# Altium project SVPXGR740_3U.PrjPcb (part 6 of 8)

## Sheet PWR_3V3.SchDoc
size A3
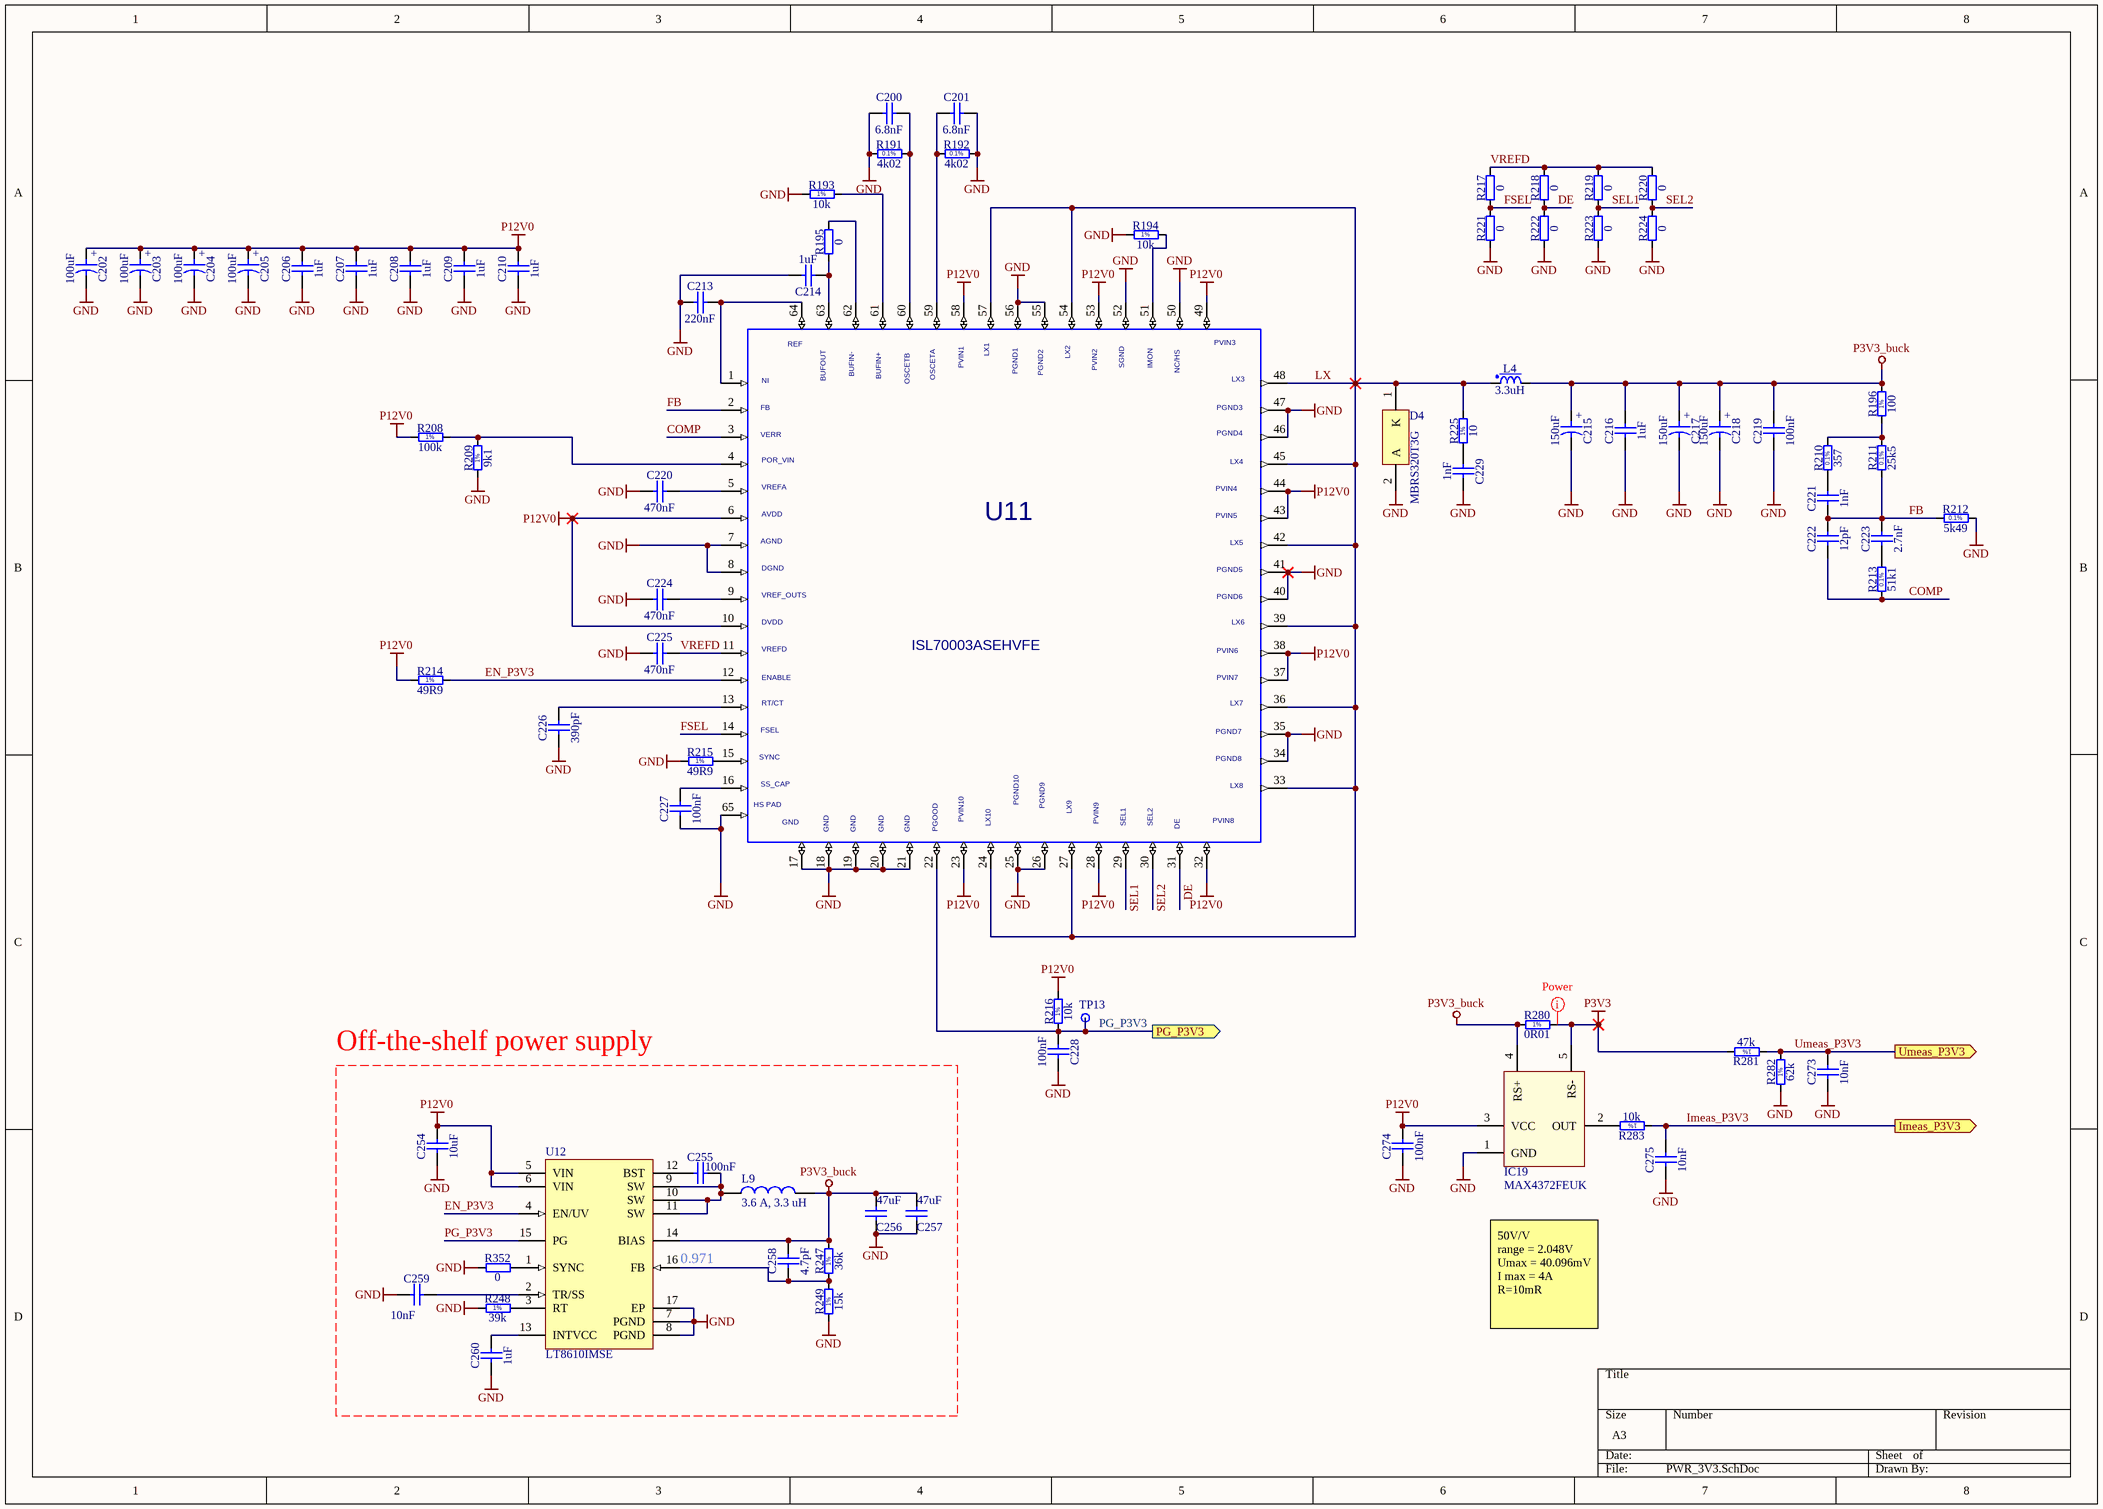
[diagram p20: PWR_3V3.SchDoc]

### Parts
C200  6.8nF  [CAPC1005X55N]
C201  6.8nF  [CAPC1005X55N]
C202  100uF  [CAPMP7343X430N]
C203  100uF  [CAPMP7343X430N]
C204  100uF  [CAPMP7343X430N]
C205  100uF  [CAPMP7343X430N]
C206  1uF  [CAPC5650X165N]
C207  1uF  [CAPC5650X165N]
C208  1uF  [CAPC5650X165N]
C209  1uF  [CAPC5650X165N]
C210  1uF  [CAPC5650X165N]
C213  220nF  [CAPC1005X55N]
C214  1uF  [CAPC1005X55N]
C215  150uF  [CAPMP6032X280N]
C216  1uF  [CAPC5650X165N]
C217  150uF  [CAPMP6032X280N]
C218  150uF  [CAPMP6032X280N]
C219  100nF  [CAPC1608X87N]
C220  470nF  [CAPC1005X55N]
C221  1nF  [CAPC1005X55N]
C222  12pF  [CAPC1005X55N]
C223  2.7nF  [CAPC1005X55N]
C224  470nF  [CAPC1005X55N]
C225  470nF  [CAPC1005X55N]
C226  390pF  [CAPC1608X87N]
C227  100nF  [CAPC1005X55N]
C228  100nF  [CAPC1005X55N]
C229  1nF  [CAPC1608X90N]
C254  10uF  [CAPC2012X95N]
C255  100nF  [CAPC1005X55N]
C256  47uF  [CAPC2012X140N]
C257  47uF  [CAPC2012X140N]
C258  4.7pF  [CAPC1005X55N]
C259  10nF  [CAPC1005X55N]
C260  1uF  [CAPC1608X87N]
C273  10nF  [CAPC1005X55N]
C274  100nF  [CAPC1005X55N]
C275  10nF  [CAPC1005X55N]
D4  MBRS320T3G  [ONSC-SMC-2-403-03_V]
IC19  MAX4372FEUK  [SOT95P270X145-5N]
L4  3.3uH  [IND_LAIRD_MGV10043R3M-10]
L9  3.6 A, 3.3 uH  [WE-MAIA_4020]
R191  4k02  [RESC1608X55N]
R192  4k02  [RESC1608X55N]
R193  10k  [RESC1005X40N]
R194  10k  [RESC1005X40N]
R195  0  [RESC1005X40N]
R196  100  [RESC1005X40N]
R208  100k  [RESC1005X40N]
R209  9k1  [RESC1005X40N]
R210  357  [RESC1608X55N]
R211  25k5  [RESC1608X55N]
R212  5k49  [RESC1608X55N]
R213  51k1  [RESC1608X55N]
R214  49R9  [RESC1608X55N]
R215  49R9  [RESC1005X40N]
R216  10k  [RESC1005X40N]
R217  0  [RESC1005X40N]
R218  0  [RESC1005X40N]
R219  0  [RESC1005X40N]
R220  0  [RESC1005X40N]
R221  0  [RESC1005X40N]
R222  0  [RESC1005X40N]
R223  0  [RESC1005X40N]
R224  0  [RESC1005X40N]
R225  10  [RESC2012X60N]
R247  36k  [RESC1005X40N]
R248  39k  [RESC1005X40N]
R249  15k  [RESC1005X40N]
R280  0R01  [RESC3216X80N]
R281  47k  [RESC1005X40N]
R282  62k  [RESC1005X40N]
R283  10k  [RESC1005X40N]
R352  0  [RESC1005X40N]
TP13  Test Point  [TPS127]  (value not drawn)
U11  PART_NUMBER: ISL70003ASEHVFE  [CQFP64_555X555_635_EP]  (hidden comment: ISL70003ASEH)
U12  LT8610IMSE  [LT-MSE-16-EDP_L]

### Ports
Imeas_P3V3 (out), PG_P3V3 (out), Umeas_P3V3 (out)

### Nets
GND: C200.1 C201.2 C202.2 C203.2 C204.2 C205.2 C206.1 C207.1 C208.1 C209.1 C210.1 C213.1 C214.2 C215.2 C216.1 C217.2 C218.2 C219.1 C220.1 C224.1 C225.1 C226.1 C227.1 C228.2 C229.2 C254.1 C256.1 C257.1 C259.1 C260.1 C273.1 C274.1 C275.1 D4.2(A) IC19.1(GND) R191.1 R192.2 R193.1 R194.1 R209.1 R212.2 R215.1 R221.1 R222.1 R223.1 R224.1 R248.1 R249.1 R282.1 R352.1 U11.7 U11.8 U11.17 U11.18 U11.19 U11.20 U11.21 U11.25 U11.26 U11.34 U11.35 U11.40 U11.41 U11.46 U11.47 U11.50 U11.52 U11.55 U11.56 U11.65(EP) U12.7(PGND) U12.8(PGND) U12.17(EP)
P3V3: IC19.5(RS-) R280.2 R281.2  [project net 3.3V]
P3V3_buck: C215.1 C216.2 C217.1 C218.1 C219.2 C256.2 C257.2 C258.2 IC19.4(RS+) L4.2 L9.2 R196.2 R247.2 R280.1 U12.14(BIAS)
P12V0: C202.1 C203.1 C204.1 C205.1 C206.2 C207.2 C208.2 C209.2 C210.2 C254.2 C274.2 IC19.3(VCC) R208.1 R214.1 R216.2 U11.6 U11.10 U11.23 U11.28 U11.32 U11.37 U11.38 U11.43 U11.44 U11.49 U11.53 U11.58 U12.5(VIN) U12.6(VIN)  [project net VS1]
COMP: C222.1 R213.1 U11.3
DE: R218.1 R222.2 U11.31
EN_P3V3: R214.2 U11.12 U12.4(EN/UV)
FB: C221.1 C222.2 C223.2 R211.1 R212.1 U11.2
FSEL: R217.1 R221.2 U11.14
Imeas_P3V3: C275.2 R283.1 ; port Imeas_P3V3
LX: D4.1(K) L4.1 R225.2 U11.24 U11.27 U11.33 U11.36 U11.39 U11.42 U11.45 U11.48 U11.54 U11.57
PG_P3V3: C228.1 R216.1 TP13.1 U11.22 U12.15(PG) ; port PG_P3V3  [project net PGP3V3]
SEL1: R219.1 R223.2 U11.29
SEL2: R220.1 R224.2 U11.30
Umeas_P3V3: C273.2 R281.1 R282.2 ; port Umeas_P3V3
VREFD: C225.2 R217.2 R218.2 R219.2 R220.2 U11.11
NetC200_2: C200.2 R191.2 U11.60
NetC201_1: C201.1 R192.1 U11.59
NetC213_2: C213.2 U11.1 U11.64
NetC214_1: C214.1 R195.1 U11.63
NetC220_2: C220.2 U11.5
NetC221_2: C221.2 R210.1
NetC223_1: C223.1 R213.2
NetC224_2: C224.2 U11.9
NetC226_2: C226.2 U11.13
NetC227_2: C227.2 U11.16
NetC229_1: C229.1 R225.1
NetC255_1: C255.1 U12.12(BST)
NetC255_2: C255.2 L9.1 U12.9(SW) U12.10(SW) U12.11(SW)
NetC258_1: C258.1 R247.1 R249.2 U12.16(FB)
NetC259_2: C259.2 U12.2(TR/SS)
NetC260_2: C260.2 U12.13(INTVCC)
NetIC19_2: IC19.2(OUT) R283.2
NetR193_2: R193.2 U11.61
NetR194_2: R194.2 U11.51
NetR195_2: R195.2 U11.62
NetR196_1: R196.1 R210.2 R211.2
NetR208_2: R208.2 R209.2 U11.4
NetR215_2: R215.2 U11.15
NetR248_2: R248.2 U12.3(RT)
NetR352_2: R352.2 U12.1(SYNC)

### Layout directives
net class Power: 3.3V

### Notes on the sheet
- Off-the-shelf power supply
- (near U12) 0.971
- 50V/V
  range = 2.048V
  Umax = 40.096mV
  I max = 4A
  R=10mR
- (in symbol CTE6032-28_150UF_10V_10%) +
- (in symbol CTE7343-43_100UF_25V_10%_LESR0150) +
- (in symbol ISL70003ASEH) REF; PVIN3; LX1; LX2; PVIN1; PVIN2; SGND; IMON; BUFIN-; BUFIN+; PGND1; PGND2; NC/HS; NI; BUFOUT; OSCETB; OSCETA; LX3; FB; PGND3; VERR; PGND4; POR_VIN; LX4; VREFA; PVIN4; AVDD; PVIN5; AGND; LX5; DGND; PGND5; VREF_OUTS; PGND6; DVDD; LX6; VREFD; PVIN6; ENABLE; PVIN7; RT/CT; LX7; FSEL; PGND7; SYNC; PGND8; SS_CAP; LX8; HS PAD; PGND10; PGND9; LX9; PVIN10; PVIN9; GND; PGOOD; LX10; SEL1; SEL2; DE; PVIN8
- (in symbol R0402_9K1_1%_0.0625W_100PPM) 1%
- (in symbol R0402_10K_1%_0.0625W_100PPM) 1%
- (in symbol R0402_15K_1%_0.0625W_100PPM) 1%
- (in symbol R0402_36K_1%_0.0625W_100PPM) 1%
- (in symbol R0402_39K_1%_0.0625W_100PPM) 1%
- (in symbol R0402_47K_1%_0.0625W_100PPM) 1%
- (in symbol R0402_49R9_1%_0.0625W_100PPM) 1%
- (in symbol R0402_62K_1%_0.0625W_100PPM) 1%
- (in symbol R0402_100K_1%_0.0625W_100PPM) 1%
- (in symbol R0402_100R_1%_0.0625W_100PPM) 1%
- (in symbol R0603_4K02_0.1%_0.063W_10PPM) 0.1%
- (in symbol R0603_5K49_0.1%_0.063W_10PPM) 0.1%
- (in symbol R0603_25K5_0.1%_0.063W_10PPM) 0.1%
- (in symbol R0603_49K9_1%_0.1W_100PPM) 1%
- (in symbol R0603_51K1_0.1%_0.063W_10PPM) 0.1%
- (in symbol R0603_357R_0.1%_0.063W_10PPM) 0.1%
- (in symbol R0805_10R_1%_0.125W_200PPM) 1%
- (in symbol R1206_0R01_1%_1W_100PPM_TT_LRMAM1206) 1%

### Library data of the parts
C200 C201 = CC0402_6.8NF_16V_10%_X7R: Non-polarised capacitor; Part Description: SMD Multilayer Chip Ceramic Capacitor; Manufacturer: GENERIC; Manufacturer1 Part Number: 223878715634; Voltage: 16V; TC: X7R; Tolerance: ±10%; Part Number: CC0402_6.8NF_16V_10%_X7R; Component Kind: Standard; Component Type: Standard; Pin Count: 2; Value: 6.8nF; Status: Not Recommended; Manufacturer Part Number: CC0402_6.8NF_16V_10%_X7R; Case: 0402; Mounted: Yes; Socket: No; SMD: Yes; Sense: No; Manufacturer1 Example: PHYCOMP; Manufacturer1 ComponentHeight: 0.55mm; HelpURL: \\cern.ch\dfs\Applications\Altium\Datasheets\CC0402_X7R_PHYCOMP.pdf; Author: CERN DEM JLC; CreateDate: 03.12.2007; LatestRevisionDate: 03.12.2007
C202-C205 = CTE7343-43_100UF_25V_10%_LESR0150: Polarised capacitor; Part Description: Low ESR 0R15 Solid Tantalum Chip Capacitor; Manufacturer: GENERIC; Manufacturer1 Part Number: TPSE107K025R0150; Voltage: 25V; Tolerance: ±10%; Part Number: CTE7343-43_100UF_25V_10%_LESR0150; Component Kind: Standard; Component Type: Standard; Pin Count: 2; Value: 100uF; Status: Preferred; Manufacturer Part Number: CTE7343-43_100UF_25V_10%_LESR0150; Case: E; Mounted: Yes; Socket: No; SMD: Yes; Sense: No; Manufacturer1 Example: AVX; Manufacturer1 ComponentHeight: 4.3mm; HelpURL: \\cern.ch\dfs\Applications\Altium\Datasheets\CTE-LESR_AVX_TPS.pdf; Author: CERN DEM JLC; CreateDate: 13.12.2018; LatestRevisionDate: 13.12.2018
C206-C210 C216 = CC2220_1UF_200V_10%_X7R: Non-polarised capacitor; Part Description: SMD Ceramic Chip Capacitor; Manufacturer: GENERIC; Manufacturer1 Part Number: C2220X105K2RAC; Voltage: 200V; TC: X7R; Tolerance: ±10%; Part Number: CC2220_1UF_200V_10%_X7R; Component Kind: Standard; Component Type: Standard; Pin Count: 2; Value: 1uF; Status: None; Manufacturer Part Number: CC2220_1UF_200V_10%_X7R; Case: 2220; Mounted: Yes; Socket: No; SMD: Yes; Sense: No; Manufacturer1 Example: KEMET; Manufacturer1 ComponentHeight: 1.65mm; HelpURL: \\cern.ch\dfs\Applications\Altium\Datasheets\CC2220_X7R_KEMET.pdf; Author: CERN DEM JLC; CreateDate: 16.09.2009; LatestRevisionDate: 16.09.2009
C213 = CC0402_220NF_16V_10%_X7R: as C181 on sheet Power; Part Number: CC0402_220NF_16V_10%_X7R; Component Kind: Standard; Component Type: Standard; Pin Count: 2; Value: 220nF; Status: Preferred; Manufacturer Part Number: CC0402_220NF_16V_10%_X7R; Case: 0402; Mounted: Yes; Socket: No; SMD: Yes; Sense: No; Manufacturer1 Example: TDK; Manufacturer1 ComponentHeight: 0.55mm; HelpURL: \\cern.ch\dfs\Applications\Altium\Datasheets\CC0402_X7R_TDK_C.pdf; Author: CERN DEM JLC; CreateDate: 25.10.2012; LatestRevisionDate: 25.10.2012
C214 = CC0402_1UF_16V_10%_X5R: as C170 on sheet Power; Part Number: CC0402_1UF_16V_10%_X5R; Component Kind: Standard; Component Type: Standard; Pin Count: 2; Value: 1uF; Status: Preferred; Manufacturer Part Number: CC0402_1UF_16V_10%_X5R; Case: 0402; Mounted: Yes; Socket: No; SMD: Yes; Sense: No; Manufacturer1 Example: TDK; Manufacturer1 ComponentHeight: 0.55mm; HelpURL: \\cern.ch\dfs\Applications\Altium\Datasheets\CC0402_X5R_TDK_C.pdf; Author: CERN DEM JLC; CreateDate: 25.10.2012; LatestRevisionDate: 25.10.2012
C215 C217 C218 = CTE6032-28_150UF_10V_10%: as C175 on sheet Power; Part Number: CTE6032-28_150UF_10V_10%; Component Kind: Standard; Component Type: Standard; Pin Count: 2; Value: 150uF; Status: Preferred; Manufacturer Part Number: CTE6032-28_150UF_10V_10%; Case: C; Mounted: Yes; Socket: No; SMD: Yes; Sense: No; Manufacturer1 Example: AVX; Manufacturer1 ComponentHeight: 2.8mm; HelpURL: \\cern.ch\dfs\Applications\Altium\Datasheets\CTE_AVX_TAJ.pdf; Author: CERN DEM JLC; CreateDate: 03.12.2007; LatestRevisionDate: 03.12.2007
C219 = CC0603_100NF_50V_10%_X5R: Non-polarised capacitor; Part Description: SMD Multilayer Chip Ceramic Capacitor; Manufacturer: GENERIC; Manufacturer1 Part Number: C1608X5R1H104K080AA; Voltage: 50V; TC: X5R; Tolerance: ±10%; Part Number: CC0603_100NF_50V_10%_X5R; Component Kind: Standard; Component Type: Standard; Pin Count: 2; Value: 100nF; Status: None; Manufacturer Part Number: CC0603_100NF_50V_10%_X5R; Case: 0603; Mounted: Yes; Socket: No; SMD: Yes; Sense: No; Manufacturer1 Example: TDK; Manufacturer1 ComponentHeight: 0.9mm; HelpURL: \\cern.ch\dfs\Applications\Altium\Datasheets\CC0603_X5R_TDK_C.pdf; Author: CERN DEM MR; CreateDate: 08.01.2016; LatestRevisionDate: 08.01.2016
C220 C224 C225 = CC0402_470NF_16V_10%_X5R: Non-polarised capacitor; Part Description: SMD Multilayer Chip Ceramic Capacitor; Manufacturer: GENERIC; Manufacturer1 Part Number: C1005X5R1C105KT; Voltage: 16V; TC: X5R; Tolerance: ±10%; Part Number: CC0402_470NF_16V_10%_X5R; Component Kind: Standard; Component Type: Standard; Pin Count: 2; Value: 470nF; Status: Preferred; Manufacturer Part Number: CC0402_470NF_16V_10%_X5R; Case: 0402; Mounted: Yes; Socket: No; SMD: Yes; Sense: No; Manufacturer1 Example: TDK; Manufacturer1 ComponentHeight: 0.55mm; HelpURL: \\cern.ch\dfs\Applications\Altium\Datasheets\CC0402_X5R_TDK_C.pdf; Author: CERN DEM JLC; CreateDate: 25.10.2012; LatestRevisionDate: 25.10.2012
C221 = CC0402_1NF_50V_10%_X7R: Non-polarised capacitor; Part Description: SMD Multilayer Chip Ceramic Capacitor; Manufacturer: GENERIC; Manufacturer1 Part Number: 223858715623; Voltage: 50V; TC: X7R; Tolerance: ±10%; Part Number: CC0402_1NF_50V_10%_X7R; Component Kind: Standard; Component Type: Standard; Pin Count: 2; Value: 1nF; Status: Not Recommended; Manufacturer Part Number: CC0402_1NF_50V_10%_X7R; Case: 0402; Mounted: Yes; Socket: No; SMD: Yes; Sense: No; Manufacturer1 Example: PHYCOMP; Manufacturer1 ComponentHeight: 0.55mm; HelpURL: \\cern.ch\dfs\Applications\Altium\Datasheets\CC0402_X7R_PHYCOMP.pdf; Author: CERN DEM JLC; CreateDate: 03.12.2007; LatestRevisionDate: 03.12.2007
C222 = CC0402_12PF_50V_5%_C0G: Non-polarised capacitor; Part Description: SMD Multilayer Chip Ceramic Capacitor; Manufacturer: GENERIC; Manufacturer1 Part Number: C0402C120J5GACTU; Voltage: 50V; TC: C0G/NP0; Tolerance: ±5%; Part Number: CC0402_12PF_50V_5%_C0G; Component Kind: Standard; Component Type: Standard; Pin Count: 2; Value: 12pF; Status: Preferred; Manufacturer Part Number: CC0402_12PF_50V_5%_C0G; Case: 0402; Mounted: Yes; Socket: No; SMD: Yes; Sense: No; Manufacturer1 Example: KEMET; Manufacturer1 ComponentHeight: 0.55mm; HelpURL: \\cern.ch\dfs\Applications\Altium\Datasheets\CC0805_C0G_KEMET_(Commercial Grade).pdf; Author: CERN DEM JLC; CreateDate: 04.10.2016; LatestRevisionDate: 04.10.2016
C223 = CC0402_2.7NF_50V_10%_X7R: Non-polarised capacitor; Part Description: SMD Multilayer Chip Ceramic Capacitor; Manufacturer: GENERIC; Manufacturer1 Part Number: 223858715628 or CC0402KRX7R9BB272; Voltage: 50V; TC: X7R; Tolerance: ±10%; Part Number: CC0402_2.7NF_50V_10%_X7R; Component Kind: Standard; Component Type: Standard; Pin Count: 2; Value: 2.7nF; Status: Preferred; Manufacturer Part Number: CC0402_2.7NF_50V_10%_X7R; Case: 0402; Mounted: Yes; Socket: No; SMD: Yes; Sense: No; Manufacturer1 Example: YAGEO PHYCOMP; Manufacturer1 ComponentHeight: 0.55mm; HelpURL: \\cern.ch\dfs\Applications\Altium\Datasheets\CC0402_X7R_PHYCOMP_6.3VTO50V.pdf; Author: CERN DEM JLC; CreateDate: 25.10.2012; LatestRevisionDate: 25.10.2012
C226 = CC0603_390PF_50V_5%_NP0: Non-polarised capacitor; Part Description: SMD Multilayer Chip Ceramic Capacitor; Manufacturer: GENERIC; Manufacturer1 Part Number: 223886715391; Voltage: 50V; TC: NP0; Tolerance: ±5%; Part Number: CC0603_390PF_50V_5%_NP0; Component Kind: Standard; Component Type: Standard; Pin Count: 2; Value: 390pF; Status: Preferred; Manufacturer Part Number: CC0603_390PF_50V_5%_NP0; Case: 0603; Mounted: Yes; Socket: No; SMD: Yes; Sense: No; Manufacturer1 Example: PHYCOMP; Manufacturer1 ComponentHeight: 0.87mm; HelpURL: \\cern.ch\dfs\Applications\Altium\Datasheets\CC0603_NP0_PHYCOMP.pdf; Author: CERN DEM JLC; CreateDate: 03.12.2007; LatestRevisionDate: 03.12.2007
C227 C228 = CC0402_100NF_16V_10%_X5R: as C177 on sheet Power; Part Number: CC0402_100NF_16V_10%_X5R; Component Kind: Standard; Component Type: Standard; Pin Count: 2; Value: 100nF; Status: None; Manufacturer Part Number: CC0402_100NF_16V_10%_X5R; Case: 0402; Mounted: Yes; Socket: No; SMD: Yes; Sense: No; Manufacturer1 Example: MURATA; Manufacturer1 ComponentHeight: 0.55mm; HelpURL: \\cern.ch\dfs\Applications\Altium\Datasheets\CC0402_X5R_MURATA_GRM.pdf; Author: CERN DEM JLC; CreateDate: 10.12.2013; LatestRevisionDate: 10.12.2013
C229 = CC0603_1NF_50V_1%_NP0: as C176 on sheet Power; Part Number: CC0603_1NF_50V_1%_NP0; Component Kind: Standard; Component Type: Standard; Pin Count: 2; Value: 1nF; Status: None; Manufacturer Part Number: CC0603_1NF_50V_1%_NP0; Case: 0603; Mounted: Yes; Socket: No; SMD: Yes; Sense: No; Manufacturer1 Example: AVX; Manufacturer1 ComponentHeight: 0.9mm; HelpURL: \\cern.ch\dfs\Applications\Altium\Datasheets\CC0603_C0G_AVX.pdf; Author: CERN DEM JLC; CreateDate: 15.06.2017; LatestRevisionDate: 15.06.2017
C254 = CC0805_10UF_25V_10%_X5R: Non-polarised capacitor; Part Description: SMD Multilayer Chip Ceramic Capacitor; Manufacturer: GENERIC; Manufacturer1 Part Number: GRM219R61E106KA12D; Voltage: 25V; TC: X5R; Tolerance: ±10%; Part Number: CC0805_10UF_25V_10%_X5R; Component Kind: Standard; Component Type: Standard; Pin Count: 2; Value: 10uF; Status: Preferred; Manufacturer Part Number: CC0805_10UF_25V_10%_X5R; Case: 0805; Mounted: Yes; Socket: No; SMD: Yes; Sense: No; Manufacturer1 Example: MURATA; Manufacturer1 ComponentHeight: 0.95mm; HelpURL: \\cern.ch\dfs\Applications\Altium\Datasheets\CC0805_X5R_MURATA_GRM.pdf; Author: CERN DEM JLC; CreateDate: 25/10/2012; LatestRevisionDate: 06/09/2016
C255 C274 = CC0402_100NF_25V_10%_X7R_YUDEN_TMK105B7104KVHF: as C270 on sheet Power; Part Number: CC0402_100NF_25V_10%_X7R_YUDEN_TMK105B7104KVHF; Component Kind: Standard; Component Type: Standard; Pin Count: 2; Value: 100nF; Status: Not Recommended; Manufacturer Part Number: TMK105B7104KVHF; Case: 0402; Mounted: Yes; Socket: No; SMD: Yes; Sense: No; ComponentHeight: 0.55mm; HelpURL: \\cern.ch\dfs\Applications\Altium\Datasheets\CC0402_TAIYO-YUDEN_TMK105B7104KVHF.pdf; Author: CERN DEM JLC; CreateDate: 10/05/2017; LatestRevisionDate: 10/05/2017
C256 C257 = CC0805_47UF_6.3V_20%_X5R: Non-polarised capacitor; Manufacturer: GENERIC; Part Description: SMD Multilayer Chip Ceramic Capacitor; Manufacturer1 Part Number: C0805C476M9PACTU; Voltage: 6.3V; TC: X5R; Tolerance: ±20%; Part Number: CC0805_47UF_6.3V_20%_X5R; Component Kind: Standard; Component Type: Standard; Pin Count: 2; Value: 47uF; Status: Preferred; Manufacturer Part Number: CC0805_47UF_6.3V_20%_X5R; Case: 0805; Mounted: Yes; Socket: No; SMD: Yes; Sense: No; Manufacturer1 Example: KEMET; Manufacturer1 ComponentHeight: 1.4mm; HelpURL: \\cern.ch\dfs\Applications\Altium\Datasheets\CC0805_X5R_KEMET.pdf; Author: CERN DEM JLC; CreateDate: 16/10/2012; LatestRevisionDate: 16/10/2012
C258 = CC0402_4.7PF_50V_0.25PF_C0G: Non-polarised capacitor; Part Description: SMD Multilayer Chip Ceramic Capacitor; Manufacturer: GENERIC; Manufacturer1 Part Number: C0402C479C5GACTU; Voltage: 50V; TC: C0G/NP0; Tolerance: ±0.25pF; Part Number: CC0402_4.7PF_50V_0.25PF_C0G; Component Kind: Standard; Component Type: Standard; Pin Count: 2; Value: 4.7pF; Status: Preferred; Manufacturer Part Number: CC0402_4.7PF_50V_0.25PF_C0G; Case: 0402; Mounted: Yes; Socket: No; SMD: Yes; Sense: No; Manufacturer1 Example: KEMET; Manufacturer1 ComponentHeight: 0.55mm; HelpURL: \\cern.ch\dfs\Applications\Altium\Datasheets\CC0805_C0G_KEMET_(Commercial Grade).pdf; Author: CERN DEM JLC; CreateDate: 03/12/2007; LatestRevisionDate: 22/04/2015
C259 = CC0402_10NF_25V_10%_X7R: Non-polarised capacitor; Part Description: SMD Multilayer Chip Ceramic Capacitor; Manufacturer: GENERIC; Manufacturer1 Part Number: C1005X7R1E103KT; Voltage: 25V; TC: X7R; Tolerance: ±10%; Part Number: CC0402_10NF_25V_10%_X7R; Component Kind: Standard; Component Type: Standard; Pin Count: 2; Value: 10nF; Status: Preferred; Manufacturer Part Number: CC0402_10NF_25V_10%_X7R; Case: 0402; Mounted: Yes; Socket: No; SMD: Yes; Sense: No; Manufacturer1 Example: TDK; Manufacturer1 ComponentHeight: 0.55mm; HelpURL: \\cern.ch\dfs\Applications\Altium\Datasheets\CC0402_X7R_TDK_C.pdf; Author: CERN DEM JLC; CreateDate: 25/10/2012; LatestRevisionDate: 25/10/2012
C260 = CC0603_1UF_25V_10%_X7R: Non-polarised capacitor; Part Description: SMD Multilayer Chip Ceramic Capacitor; Manufacturer: GENERIC; Manufacturer1 Part Number: GRM188R71E105KA12D; Voltage: 25V; TC: X7R; Tolerance: ±10%; Part Number: CC0603_1UF_25V_10%_X7R; Component Kind: Standard; Component Type: Standard; Pin Count: 2; Value: 1uF; Status: None; Manufacturer Part Number: CC0603_1UF_25V_10%_X7R; Case: 0603; Mounted: Yes; Socket: No; SMD: Yes; Sense: No; Manufacturer1 Example: MURATA; Manufacturer1 ComponentHeight: 0.9mm; HelpURL: \\cern.ch\dfs\Applications\Altium\Datasheets\CC0603_X7R_MURATA.pdf; Author: CERN DEM JLC; CreateDate: 18/01/2011; LatestRevisionDate: 18/01/2011
C273 C275 = CC0402_10NF_50V_10%_X7R: as C267-C269 on sheet Power; Part Number: CC0402_10NF_50V_10%_X7R; Component Kind: Standard; Component Type: Standard; Pin Count: 2; Value: 10nF; Status: None; Manufacturer Part Number: CC0402_10NF_50V_10%_X7R; Case: 0402; Mounted: Yes; Socket: No; SMD: Yes; Sense: No; Manufacturer1 Example: MURATA; Manufacturer1 ComponentHeight: 0.55mm; HelpURL: \\cern.ch\dfs\Applications\Altium\Datasheets\CC0402_X7R_MURATA_GRM.pdf; Author: CERN DEM MR; CreateDate: 08/01/2016; LatestRevisionDate: 08/01/2016
D4 = CMP-1055-00376-1: Schottky Power Rectifier, 2-Pin SMC, Pb-Free, Tape and Reel; Manufacturer: On Semiconductor; Configuration: Single; IFSM Max (A): 80; PackageVersion: Rev. E, 08/2005; DatasheetVersion: Rev. 11; PackageReference: SMC-2-403-03; ComponentLink3URL: http://www.onsemi.com/pub_link/Collateral/403-03.PDF; ComponentLink2Description: Datasheet; ComponentLink3Description: Package Specification; PackageDescription: 2-Pin Small Molded Package, J-Bend Lead, Body 5.845 x 6.855 mm; ComponentLink1URL: http://www.onsemi.com/; PartNumber: MBRS320T3G; ComponentLink1Description: Manufacturer URL; Packing: Tape and Reel; RoHS: TRUE; ComponentLink2URL: http://www.onsemi.cn/pub_link/Collateral/MBRS340T3-D.PDF; Mounting Technology: Surface Mount
IC19 = PM_MAX4372FEUK: Manufacturer: Maxim; Part Description: High side current sense amplifier (x50); Bonding: No; PressFit: No; Case: SOT23-5; Component Kind: Standard; Component Type: Standard; ComponentHeigth: *; CreateDate: 2018-01-01; Device: MAX4372FEUK; Footprint: SOT23-5; HelpURL: *; LatestRevisionDate: 2018-01-01; Manufacturer Part Number: MAX4372FEUK; Mounted: Yes; PackageDescription: SOT23-5; Part Number: MAX4372FEUK; Pin Count: 5; Sense: No; SMD: Yes; Socket: No; Value: MAX4372FEUK
L4 = IND_3.3UH_20%_LAIRD_MGV10043R3M-10: Inductor With Magnetic core 1Dot; Part Description: High Current & Low Profile SMD Power Inductor; Manufacturer: LAIRD TECHNOLOGIES; Power: 10A; Resistance: 0.0118R; Tolerance: ±20%; Part Number: IND_3.3UH_20%_LAIRD_MGV10043R3M-10; Component Kind: Standard; Component Type: Standard; Pin Count: 2; Value: 3.3uH; Status: None; Manufacturer Part Number: MGV10043R3M-10; Mounted: Yes; Socket: No; SMD: Yes; Sense: No; ComponentHeight: 4.3mm; HelpURL: \\cern.ch\dfs\Applications\Altium\Datasheets\IND_LAIRD_MGV10043R3M-10.pdf; Author: CERN DEM BC; CreateDate: 07.09.2015; LatestRevisionDate: 07.09.2015
L9 = 78438356033: WE-MAIA SMD Power Inductor, size 4020, 3.6 A, 3.3 uH; Rated Current: 3.6 A; Inductance: 3.3 uH; DC Resistance max.: 48 mOhm; ComponentLink1Description: Manufacturer; ComponentLink1URL: http://www.we-online.de; ComponentLink2Description: Datasheet; ComponentLink2URL: http://katalog.we-online.de/pbs/datasheet/78438356033.pdf; Part Number: 78438356033; Published Date: Nov. 2017; Publisher: Wurth Elektronik; Size: 4020; Operating Temperature: -40 to 125 degC
R191 R192 = R0603_4K02_0.1%_0.063W_10PPM: Resistor - 0.1%; Part Description: Thin Film Chip Resistor; Manufacturer: GENERIC; Manufacturer1 Part Number: RN73C1J4K02BTDF; Power: 0.063W; TC: ±10ppm; PressFit: No; Part Number: R0603_4K02_0.1%_0.063W_10PPM; Component Kind: Standard; Component Type: Standard; Pin Count: 2; Value: 4k02; Status: Not Recommended; Tolerance: ±0.1%; Manufacturer Part Number: R0603_4K02_0.1%_0.063W_10PPM; Case: 0603; Mounted: Yes; Sense: No; Socket: No; SMD: Yes; Manufacturer1 Example: TYCO HOLSWORTHY; Manufacturer1 ComponentHeight: 0.5mm; HelpURL: \\cern.ch\dfs\Applications\Altium\Datasheets\R0603_Tyco_RN73.pdf; Author: CERN DEM JLC; CreateDate: 03.12.2007; LatestRevisionDate: 13.03.2008
R193 R194 R216 R283 = R0402_10K_1%_0.0625W_100PPM: as R177 on sheet Power; Part Number: R0402_10K_1%_0.0625W_100PPM; Component Kind: Standard; Component Type: Standard; Pin Count: 2; Value: 10k; Status: Not Recommended; Power: 0.0625W; Tolerance: ±1%; Manufacturer Part Number: R0402_10K_1%_0.0625W_100PPM; Case: 0402; Mounted: Yes; Sense: No; Socket: No; SMD: Yes; Manufacturer1 Example: YAGEO PHYCOMP; Manufacturer1 ComponentHeight: 0.4mm; HelpURL: \\cern.ch\dfs\Applications\Altium\Datasheets\R0402_Phycomp_RC0402.pdf; Author: CERN DEM JLC
  R193 R194 R216: CreateDate: 03.12.2007; LatestRevisionDate: 17.10.2012
  R283: CreateDate: 03/12/2007; LatestRevisionDate: 17/10/2012
R195 R217-R224 R352 = R0402_0R_JUMPER: as R175 on sheet Power; Part Number: R0402_0R_JUMPER; Component Kind: Standard; Component Type: Standard; Pin Count: 2; Value: 0; Status: Not Recommended; Manufacturer Part Number: R0402_0R_JUMPER; Case: 0402; Mounted: Yes; Sense: No; Socket: No; SMD: Yes; Manufacturer1 Example: YAGEO PHYCOMP; Manufacturer1 ComponentHeight: 0.4mm; HelpURL: \\cern.ch\dfs\Applications\Altium\Datasheets\R0402_Phycomp_RC0402.pdf; Author: CERN DEM JLC; CreateDate: 03.12.2007; LatestRevisionDate: 17.10.2012
R196 = R0402_100R_1%_0.0625W_100PPM: as R34 on sheet Flash; Part Number: R0402_100R_1%_0.0625W_100PPM; Component Kind: Standard; Component Type: Standard; Pin Count: 2; Value: 100; Status: Not Recommended; Power: 0.0625W; Tolerance: ±1%; Manufacturer Part Number: R0402_100R_1%_0.0625W_100PPM; Case: 0402; Mounted: Yes; Sense: No; Socket: No; SMD: Yes; Manufacturer1 Example: YAGEO PHYCOMP; Manufacturer1 ComponentHeight: 0.4mm; HelpURL: \\cern.ch\dfs\Applications\Altium\Datasheets\R0402_Phycomp_RC0402.pdf; Author: CERN DEM JLC; CreateDate: 03.12.2007; LatestRevisionDate: 17.10.2012
R208 = R0402_100K_1%_0.0625W_100PPM: as R243 on sheet Power; Part Number: R0402_100K_1%_0.0625W_100PPM; Component Kind: Standard; Component Type: Standard; Pin Count: 2; Value: 100k; Status: Not Recommended; Power: 0.0625W; Tolerance: ±1%; Manufacturer Part Number: R0402_100K_1%_0.0625W_100PPM; Case: 0402; Mounted: Yes; Sense: No; Socket: No; SMD: Yes; Manufacturer1 Example: YAGEO PHYCOMP; Manufacturer1 ComponentHeight: 0.4mm; HelpURL: \\cern.ch\dfs\Applications\Altium\Datasheets\R0402_Phycomp_RC0402.pdf; Author: CERN DEM JLC; CreateDate: 03.12.2007; LatestRevisionDate: 17.10.2012
R209 = R0402_9K1_1%_0.0625W_100PPM: Resistor - 1%; Part Description: General Purpose Thick Film Chip Resistor; Manufacturer: GENERIC; Manufacturer1 Part Number: 232270679102L; TC: ±100ppm/°C; PressFit: No; Part Number: R0402_9K1_1%_0.0625W_100PPM; Component Kind: Standard; Component Type: Standard; Pin Count: 2; Value: 9k1; Status: Not Recommended; Power: 0.0625W; Tolerance: ±1%; Manufacturer Part Number: R0402_9K1_1%_0.0625W_100PPM; Case: 0402; Mounted: Yes; Sense: No; Socket: No; SMD: Yes; Manufacturer1 Example: YAGEO PHYCOMP; Manufacturer1 ComponentHeight: 0.4mm; HelpURL: \\cern.ch\dfs\Applications\Altium\Datasheets\R0402_Phycomp_RC0402.pdf; Author: CERN DEM JLC; CreateDate: 03.12.2007; LatestRevisionDate: 17.10.2012
R210 = R0603_357R_0.1%_0.063W_10PPM: Resistor - 0.1%; Part Description: Thin Film Chip Resistor; Manufacturer: GENERIC; Manufacturer1 Part Number: RN73C1J357RBTDF; Power: 0.063W; TC: ±10ppm; PressFit: No; Part Number: R0603_357R_0.1%_0.063W_10PPM; Component Kind: Standard; Component Type: Standard; Pin Count: 2; Value: 357; Status: Not Recommended; Tolerance: ±0.1%; Manufacturer Part Number: R0603_357R_0.1%_0.063W_10PPM; Case: 0603; Mounted: Yes; Sense: No; Socket: No; SMD: Yes; Manufacturer1 Example: TYCO HOLSWORTHY; Manufacturer1 ComponentHeight: 0.5mm; HelpURL: \\cern.ch\dfs\Applications\Altium\Datasheets\R0603_Tyco_RN73.pdf; Author: CERN DEM JLC; CreateDate: 03.12.2007; LatestRevisionDate: 13.03.2008
R211 = R0603_25K5_0.1%_0.063W_10PPM: Resistor - 0.1%; Part Description: Thin Film Chip Resistor; Manufacturer: GENERIC; Manufacturer1 Part Number: RN73C1J25K5BTDF; Power: 0.063W; TC: ±10ppm; PressFit: No; Part Number: R0603_25K5_0.1%_0.063W_10PPM; Component Kind: Standard; Component Type: Standard; Pin Count: 2; Value: 25k5; Status: Not Recommended; Tolerance: ±0.1%; Manufacturer Part Number: R0603_25K5_0.1%_0.063W_10PPM; Case: 0603; Mounted: Yes; Sense: No; Socket: No; SMD: Yes; Manufacturer1 Example: TYCO HOLSWORTHY; Manufacturer1 ComponentHeight: 0.5mm; HelpURL: \\cern.ch\dfs\Applications\Altium\Datasheets\R0603_Tyco_RN73.pdf; Author: CERN DEM JLC; CreateDate: 03.12.2007; LatestRevisionDate: 13.03.2008
R212 = R0603_5K49_0.1%_0.063W_10PPM: Resistor - 0.1%; Part Description: Thin Film Chip Resistor; Manufacturer: GENERIC; Manufacturer1 Part Number: RN73C1J5K49BTDF; Power: 0.063W; TC: ±10ppm; PressFit: No; Part Number: R0603_5K49_0.1%_0.063W_10PPM; Component Kind: Standard; Component Type: Standard; Pin Count: 2; Value: 5k49; Status: Not Recommended; Tolerance: ±0.1%; Manufacturer Part Number: R0603_5K49_0.1%_0.063W_10PPM; Case: 0603; Mounted: Yes; Sense: No; Socket: No; SMD: Yes; Manufacturer1 Example: TYCO HOLSWORTHY; Manufacturer1 ComponentHeight: 0.5mm; HelpURL: \\cern.ch\dfs\Applications\Altium\Datasheets\R0603_Tyco_RN73.pdf; Author: CERN DEM JLC; CreateDate: 03.12.2007; LatestRevisionDate: 13.03.2008
R213 = R0603_51K1_0.1%_0.063W_10PPM: Resistor - 0.1%; Part Description: Thin Film Chip Resistor; Manufacturer: GENERIC; Manufacturer1 Part Number: RN73C1J51K1BTDF; Power: 0.063W; TC: ±10ppm; PressFit: No; Part Number: R0603_51K1_0.1%_0.063W_10PPM; Component Kind: Standard; Component Type: Standard; Pin Count: 2; Value: 51k1; Status: Not Recommended; Tolerance: ±0.1%; Manufacturer Part Number: R0603_51K1_0.1%_0.063W_10PPM; Case: 0603; Mounted: Yes; Sense: No; Socket: No; SMD: Yes; Manufacturer1 Example: TYCO HOLSWORTHY; Manufacturer1 ComponentHeight: 0.5mm; HelpURL: \\cern.ch\dfs\Applications\Altium\Datasheets\R0603_Tyco_RN73.pdf; Author: CERN DEM JLC; CreateDate: 03.12.2007; LatestRevisionDate: 13.03.2008
R214 = R0603_49K9_1%_0.1W_100PPM: Resistor - 1%; Part Description: General Purpose Thick Film Chip Resistor; Manufacturer: GENERIC; Manufacturer Part Number: R0603_49R9_1%_0.1W_100PPM; Manufacturer1 Part Number: CRCW060349R9FKEA; Power: 0.1W; TC: ±100ppm/°C; PressFit: No; Part Number: R0603_49K9_1%_0.1W_100PPM; Component Kind: Standard; Component Type: Standard; Pin Count: 2; Value: 49R9; Status: Preferred; Tolerance: ±1%; Case: 0603; Mounted: Yes; Sense: No; Socket: No; SMD: Yes; Manufacturer1 Example: VISHAY; Manufacturer1 ComponentHeight: 0.55mm; HelpURL: \\cern.ch\dfs\Applications\Altium\Datasheets\R0603_VISHAY_CRCW e3.pdf; Author: CERN DEM JLC; CreateDate: 16.11.2017; LatestRevisionDate: 16.11.2017
R215 = R0402_49R9_1%_0.0625W_100PPM: Resistor - 1%; Part Description: General Purpose Thick Film Chip Resistor; Manufacturer: GENERIC; Manufacturer1 Part Number: 232270674999L or RC0402FR-0749R9L; TC: ±100ppm/°C; PressFit: No; Part Number: R0402_49R9_1%_0.0625W_100PPM; Component Kind: Standard; Component Type: Standard; Pin Count: 2; Value: 49R9; Status: Not Recommended; Power: 0.0625W; Tolerance: ±1%; Manufacturer Part Number: R0402_49R9_1%_0.0625W_100PPM; Case: 0402; Mounted: Yes; Sense: No; Socket: No; SMD: Yes; Manufacturer1 Example: YAGEO PHYCOMP; Manufacturer1 ComponentHeight: 0.4mm; HelpURL: \\cern.ch\dfs\Applications\Altium\Datasheets\R0402_Phycomp_RC0402.pdf; Author: CERN DEM JLC; CreateDate: 24.10.2012; LatestRevisionDate: 24.10.2012
R225 = R0805_10R_1%_0.125W_200PPM: as R176 on sheet Power; Part Number: R0805_10R_1%_0.125W_200PPM; Component Kind: Standard; Component Type: Standard; Pin Count: 2; Value: 10; Status: Preferred; Tolerance: ±1%; Manufacturer Part Number: R0805_10R_1%_0.125W_200PPM; Case: 0805; Mounted: Yes; Sense: No; Socket: No; SMD: Yes; Manufacturer1 Example: NIC COMPONENT; Manufacturer1 ComponentHeight: 0.6mm; HelpURL: \\cern.ch\dfs\Applications\Altium\Datasheets\R0805_NIC_NRC.pdf; Author: CERN DEM JLC; CreateDate: 03.12.2007; LatestRevisionDate: 24.06.2009
R247 = R0402_36K_1%_0.0625W_100PPM: as R244 on sheet Power; Part Number: R0402_36K_1%_0.0625W_100PPM; Component Kind: Standard; Component Type: Standard; Pin Count: 2; Value: 36k; Status: Not Recommended; Power: 0.0625W; Tolerance: ±1%; Manufacturer Part Number: R0402_36K_1%_0.0625W_100PPM; Case: 0402; Mounted: Yes; Sense: No; Socket: No; SMD: Yes; Manufacturer1 Example: YAGEO PHYCOMP; Manufacturer1 ComponentHeight: 0.4mm; HelpURL: \\cern.ch\dfs\Applications\Altium\Datasheets\R0402_Phycomp_RC0402.pdf; Author: CERN DEM JLC; CreateDate: 03/12/2007; LatestRevisionDate: 17/10/2012
R248 = R0402_39K_1%_0.0625W_100PPM: Resistor - 1%; Part Description: General Purpose Thick Film Chip Resistor; Manufacturer: GENERIC; Manufacturer1 Part Number: 232270673903; TC: ±100ppm/°C; PressFit: No; Part Number: R0402_39K_1%_0.0625W_100PPM; Component Kind: Standard; Component Type: Standard; Pin Count: 2; Value: 39k; Status: Not Recommended; Power: 0.0625W; Tolerance: ±1%; Manufacturer Part Number: R0402_39K_1%_0.0625W_100PPM; Case: 0402; Mounted: Yes; Sense: No; Socket: No; SMD: Yes; Manufacturer1 Example: YAGEO PHYCOMP; Manufacturer1 ComponentHeight: 0.4mm; HelpURL: \\cern.ch\dfs\Applications\Altium\Datasheets\R0402_Phycomp_RC0402.pdf; Author: CERN DEM JLC; CreateDate: 03/12/2007; LatestRevisionDate: 17/10/2012
R249 = R0402_15K_1%_0.0625W_100PPM: Resistor - 1%; Part Description: General Purpose Thick Film Chip Resistor; Manufacturer: GENERIC; Manufacturer1 Part Number: CRCW040215K0FKED; TC: ±100ppm/°C; PressFit: No; Part Number: R0402_15K_1%_0.0625W_100PPM; Component Kind: Standard; Component Type: Standard; Pin Count: 2; Value: 15k; Status: None; Power: 0.0625W; Tolerance: ±1%; Manufacturer Part Number: R0402_15K_1%_0.0625W_100PPM; Case: 0402; Mounted: Yes; Sense: No; Socket: No; SMD: Yes; Manufacturer1 Example: VISHAY; Manufacturer1 ComponentHeight: 0.4mm; HelpURL: \\cern.ch\dfs\Applications\Altium\Datasheets\R0402_VISHAY_CRCW e3.pdf; Author: CERN DEM JMW; CreateDate: 06/07/2015; LatestRevisionDate: 06/07/2015
R280 = R1206_0R01_1%_1W_100PPM_TT_LRMAM1206: Resistor - 1%; Part Description: Low Value Metal Alloy Resistor; Manufacturer: TT Electronics; Manufacturer Part Number: LRMAM1206-R01FT5; Power: 1W; TC: ±100ppm/°C; PressFit: No; Part Number: R1206_0R01_1%_1W_100PPM_TT_LRMAM1206; Component Kind: Standard; Component Type: Standard; Pin Count: 2; Value: 0R01; Status: Not Recommended; Tolerance: ±1%; Case: 1206; Mounted: Yes; Sense: No; Socket: No; SMD: Yes; ComponentHeight: 0.8mm; HelpURL: \\cern.ch\dfs\Applications\Altium\Datasheets\R1206_TT ELECTRONICS_LRMA.pdf; Author: CERN DEM BC; CreateDate: 29/07/2015; LatestRevisionDate: 29/07/2015
R281 = R0402_47K_1%_0.0625W_100PPM: as R9-R29 on sheet Flash; Part Number: R0402_47K_1%_0.0625W_100PPM; Component Kind: Standard; Component Type: Standard; Pin Count: 2; Value: 47k; Status: Not Recommended; Power: 0.0625W; Tolerance: ±1%; Manufacturer Part Number: R0402_47K_1%_0.0625W_100PPM; Case: 0402; Mounted: Yes; Sense: No; Socket: No; SMD: Yes; Manufacturer1 Example: YAGEO PHYCOMP; Manufacturer1 ComponentHeight: 0.4mm; HelpURL: \\cern.ch\dfs\Applications\Altium\Datasheets\R0402_Phycomp_RC0402.pdf; Author: CERN DEM JLC; CreateDate: 03/12/2007; LatestRevisionDate: 17/10/2012
R282 = R0402_62K_1%_0.0625W_100PPM: Resistor - 1%; Part Description: General Purpose Thick Film Chip Resistor; Manufacturer: GENERIC; Manufacturer1 Part Number: 232270676203L; TC: ±100ppm/°C; PressFit: No; Part Number: R0402_62K_1%_0.0625W_100PPM; Component Kind: Standard; Component Type: Standard; Pin Count: 2; Value: 62k; Status: Not Recommended; Power: 0.0625W; Tolerance: ±1%; Manufacturer Part Number: R0402_62K_1%_0.0625W_100PPM; Case: 0402; Mounted: Yes; Sense: No; Socket: No; SMD: Yes; Manufacturer1 Example: YAGEO PHYCOMP; Manufacturer1 ComponentHeight: 0.4mm; HelpURL: \\cern.ch\dfs\Applications\Altium\Datasheets\R0402_Phycomp_RC0402.pdf; Author: CERN DEM JLC; CreateDate: 03/12/2007; LatestRevisionDate: 17/10/2012
TP13 = SMD_PAD_1.27X1.27MM: as TP11 on sheet Power; Part Number: SMD_PAD_1.27X1.27MM; Component Kind: Standard (No BOM); Component Type: Standard (No BOM); Pin Count: 1; Family: Test Point; Socket: No; SMD: No; Sense: No; Status: None; ComponentHeight: 0mm; HelpURL: Undefined; Author: CERN DEM JLC; CreateDate: 12.01.2008; LatestRevisionDate: 12.01.2008; PackageDescription: 1.27mm x 1.27mm PCB Copper Area (SMD Test Point)
U11 = ISL70003ASEH: CDS_PART_NAME: ISL70003ASEH_CQFPEP-ISL70003ASB; OriginalSymbolOrigin: (-950,950); PACK_TYPE: CQFPEP; FILE_PATH: ./MODELS; CDS_LIB: regulators; CDS_LOCATION: U1; DRAWING: @ISL70003ASEH_LIB.ISL70003ASEHEV1ZB(SCH_1):PAGE1; PHYS_PAGE: 1; ROT: 0; VER: 3; XY: (-2400,6000); PART_NAME: ISL70003ASEH; FILE_NAME: ISL70003ASEH; CDS_PHYS_PART_NAME: ISL70003ASEH_CQFPEP-ISL70003ASB; CHIPS_PART_NAME: ISL70003ASEH; LOCATION: U1; SEC_TYPE: CQFPEP
U12 = CMP-0491-01209-1: 2.5 A Synchronous Step-Down Regulator 2.5 uA Quiescent Current, 16-pin SOP (MSE-16-EDP), -40 to 125 degC; Manufacturer: Linear Technology; Number of Outputs: 1; Frequency Adjust Range: 200kHz - 2.2MHz; ComponentLink1URL: http://www.linear.com/; PackageVersion: Rev. F, 05/2013; PackageDescription: 16-Pin Plastic MSOP, Exposed Die Pad, Body 4.039 x 3 mm, Pitch 0.5 mm; ComponentLink3URL: http://cds.linear.com/docs/en/packaging/05081667_F_MSE16.pdf; ComponentLink2Description: Datasheet; PackageReference: MSE-16; Mounting Technology: Surface Mount; PartNumber: LT8610IMSE; RoHS: FALSE; ComponentLink3Description: Package Specification; ComponentLink1Description: Manufacturer URL; ComponentLink2URL: http://cds.linear.com/docs/en/datasheet/8610f.pdf